# EAGLE design board (EAGLE 7.2.0)
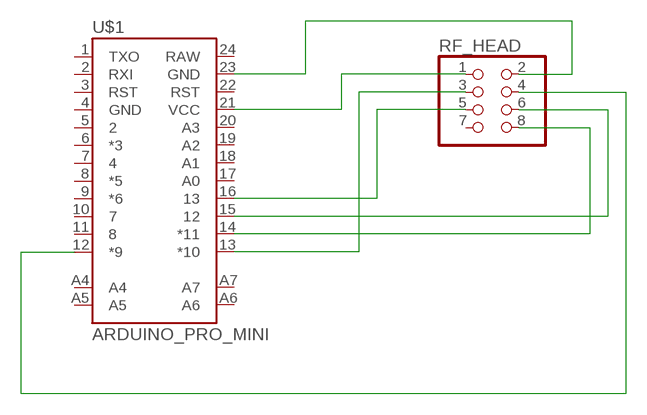
[diagram p0: schematic, sheet 1]

## Parts
RF_HEAD  PINHD-2X4  [2X04]
U$1  ARDUINO_PRO_MINI  [ARDUINO_PRO_MINI]

## Nets
N$1: RF_HEAD.1 U$1.21(VCC)
N$2: RF_HEAD.2 U$1.23(GND)
N$3: RF_HEAD.3 U$1.13(*10)
N$4: RF_HEAD.4 U$1.12(*9)
N$5: RF_HEAD.5 U$1.16
N$6: RF_HEAD.6 U$1.15
N$7: RF_HEAD.8 U$1.14(*11)
Unconnected: RF_HEAD.7 U$1.1(TXO) U$1.2(RXI) U$1.3(RST) U$1.4(GND) U$1.5 U$1.6(*3) U$1.7 U$1.8(*5) U$1.9(*6) U$1.10 U$1.11 U$1.17(A0) U$1.18(A1) U$1.19(A2) U$1.20(A3) U$1.22(RST) U$1.24(RAW) U$1.A4 U$1.A5 U$1.A6 U$1.A7

## Library data of the parts
RF_HEAD = pinhead:PINHD-2X4: PIN HEADER
U$1 = SparkFun-Boards:ARDUINO_PRO_MINI

## Board
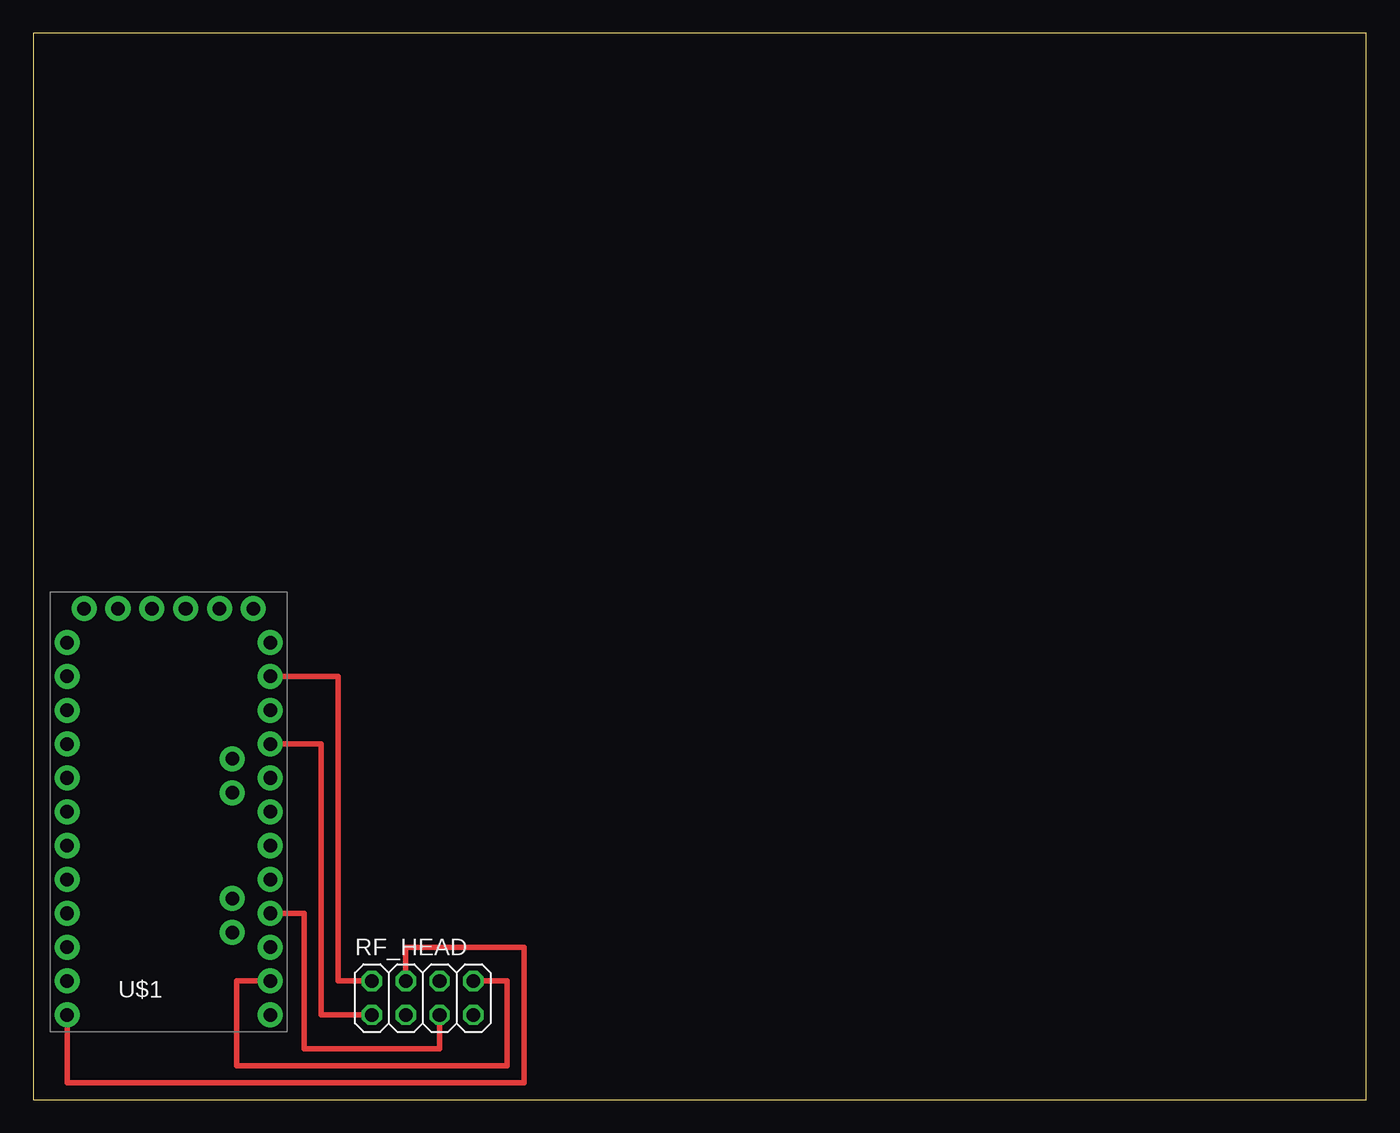
[diagram p1: board, top side]
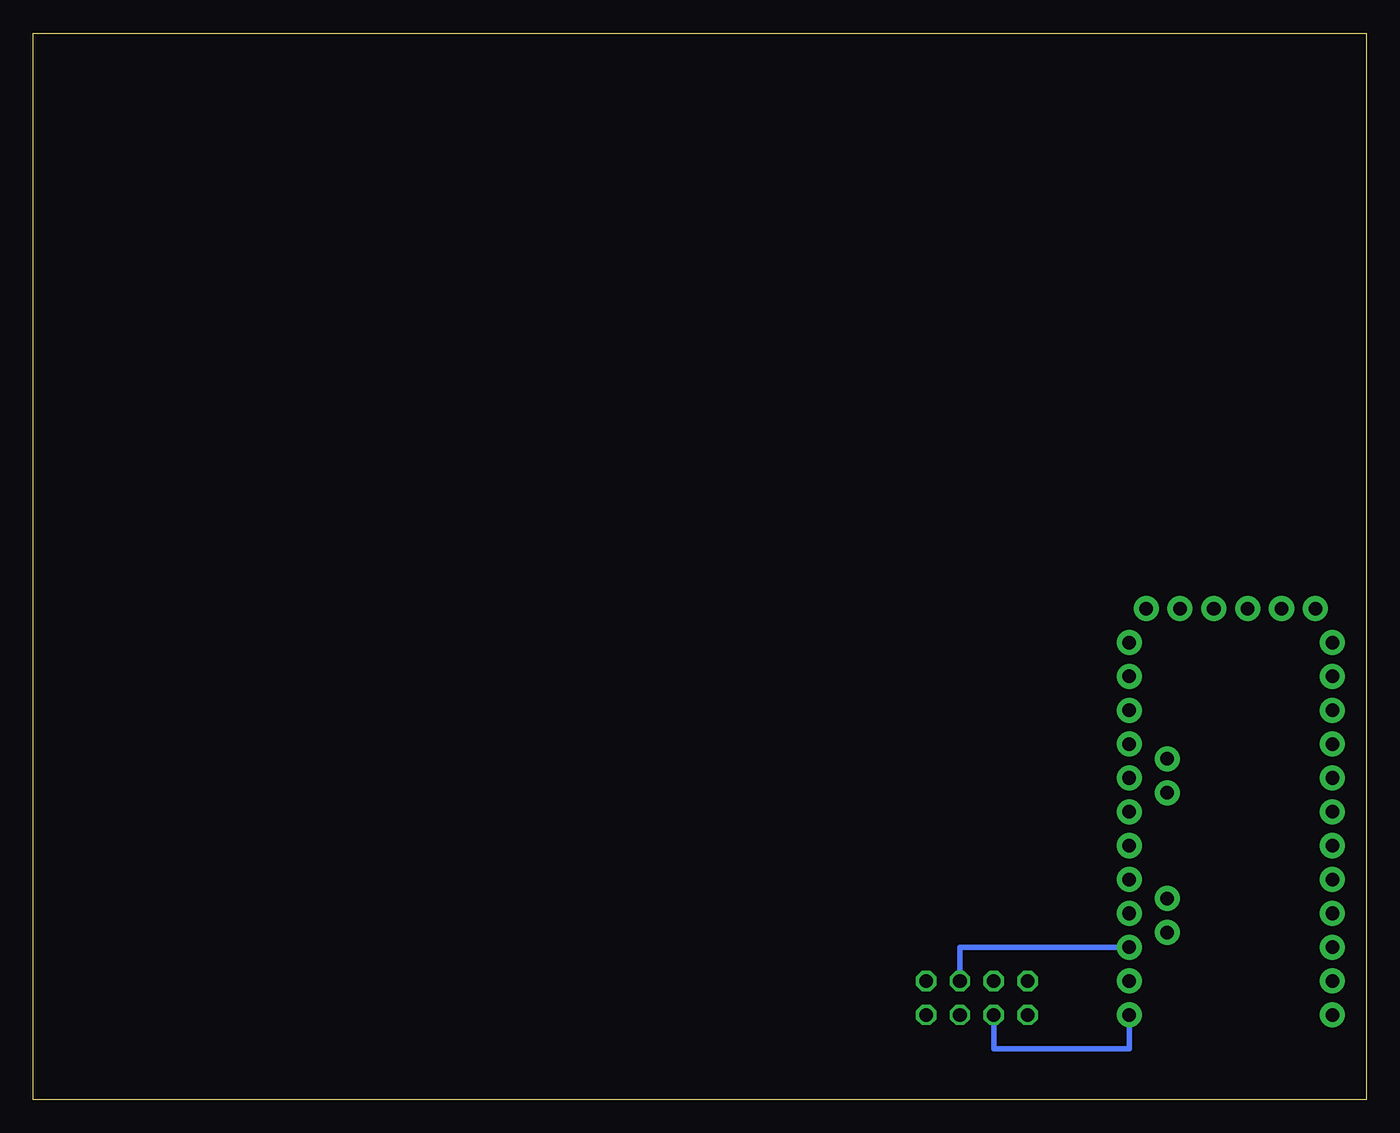
[diagram p2: board, bottom side, seen from below]

Size 100 x 80 mm. Coordinates in mm from the lower left corner, seen from the top.
Outline: 0,0 100,0 100,80 0,80 0,0
Copper layers (1*16): Top 0.035mm / dielectric 1.5mm / Bottom 0.035mm
Design rules "default": minimum track width 10mil, minimum drill 24mil, track to track 8mil, track to pad 8mil, pad to pad 8mil, via to via 8mil, smd to smd 8mil, copper to edge 40mil, drill to drill 8mil, minimum pad ring 10mil, minimum via ring 8mil, stop-mask expansion 4mil, vias tented up to drill 0mil, thermal gap 10mil

### Footprints (pad centres in the part's own frame; a part is rotated, then mirrored left to right if it is on the bottom)
2X04 = drill 1.016 octagon: 1 -3.81,-1.27; 2 -3.81,1.27; 3 -1.27,-1.27; 4 -1.27,1.27; 5 1.27,-1.27; 6 1.27,1.27; 7 3.81,-1.27; 8 3.81,1.27
ARDUINO_PRO_MINI = drill 1.016 pad 1.88: 1 -7.62,12.7; 2 -7.62,10.16; 3 -7.62,7.62; 4 -7.62,5.08; 5 -7.62,2.54; 6 -7.62,0; 7 -7.62,-2.54; 8 -7.62,-5.08; 9 -7.62,-7.62; 10 -7.62,-10.16; 11 -7.62,-12.7; 12 -7.62,-15.24; 13 7.62,-15.24; 14 7.62,-12.7; 15 7.62,-10.16; 16 7.62,-7.62; 17 7.62,-5.08; 18 7.62,-2.54; 19 7.62,0; 20 7.62,2.54; 21 7.62,5.08; 22 7.62,7.62; 23 7.62,10.16; 24 7.62,12.7; A4 4.763,1.429; A5 4.763,3.969; A6 4.763,-9.049; A7 4.763,-6.509; BLK -6.35,15.24; GND -3.81,15.24; GRN 6.35,15.24; RXI 1.27,15.24; TXO 3.81,15.24; VCC -1.27,15.24

### Placement (x,y rotation side)
RF_HEAD  29.21,7.62 0 top
U$1  10.16,21.59 0 top

### Tracks (layer width: path | path; a pad name or v marks a point on that pad's centre or on a via)
N$1
  Top 0.406: RF_HEAD.1 21.59,6.35 21.59,26.67 U$1.21
N$2
  Top 0.406: RF_HEAD.2 22.86,8.89 22.86,31.75 U$1.23
N$3
  Bottom 0.406: RF_HEAD.3 27.94,3.81 17.78,3.81 U$1.13
N$4
  Top 0.406: RF_HEAD.4 27.94,11.43 36.83,11.43 36.83,1.27 2.54,1.27 U$1.12
N$5
  Top 0.406: RF_HEAD.5 30.48,3.81 20.32,3.81 20.32,13.97 U$1.16
N$6
  Bottom 0.406: RF_HEAD.6 30.48,11.43 U$1.15
N$7
  Top 0.406: RF_HEAD.8 35.56,8.89 35.56,2.54 15.24,2.54 15.24,8.89 U$1.14